# Altium schematic sheet Open_Rally_Computer_ports.SchDoc
size 594 x 420 mm
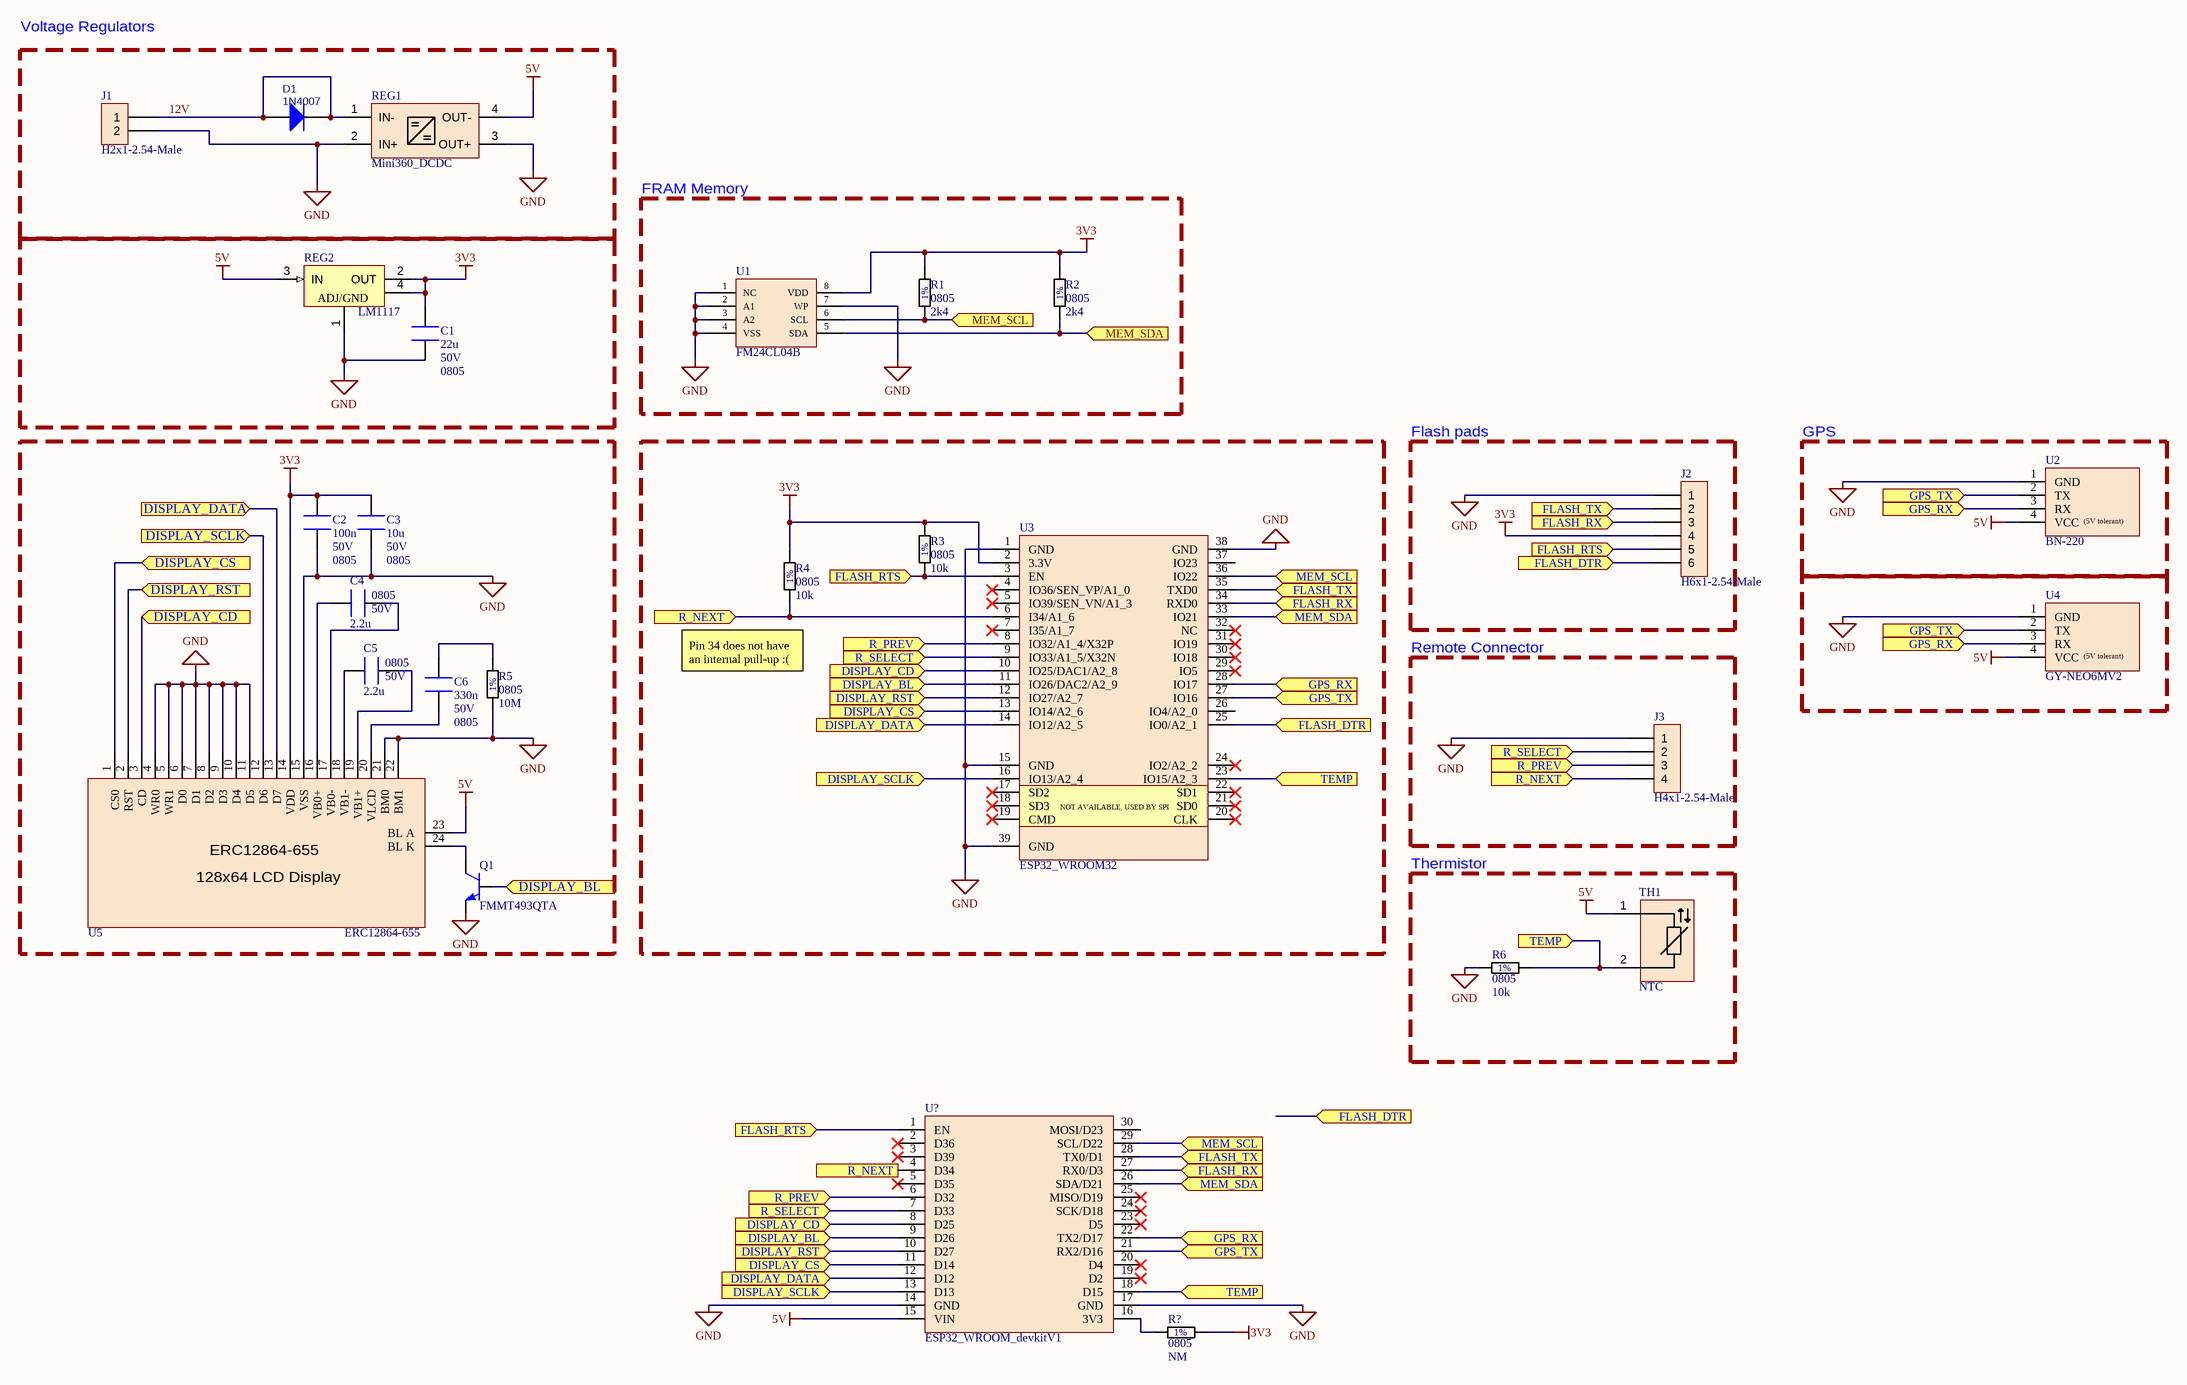
[diagram p0: Open_Rally_Computer_ports.SchDoc]

## Parts
C1  value 22u  Voltage: 50V  Case: 0805  [C0805]  (hidden comment: CAP_CERAMIC_0805)
C2  value 100n  Voltage: 50V  Case: 0805  [C0805]  (hidden comment: CAP_CERAMIC_0805)
C3  value 10u  Voltage: 50V  Case: 0805  [C0805]  (hidden comment: CAP_CERAMIC_0805)
C4  value 2.2u  Voltage: 50V  Case: 0805  [C0805]  (hidden comment: CAP_CERAMIC_0805)
C5  value 2.2u  Voltage: 50V  Case: 0805  [C0805]  (hidden comment: CAP_CERAMIC_0805)
C6  value 330n  Voltage: 50V  Case: 0805  [C0805]  (hidden comment: CAP_CERAMIC_0805)
D1  1N4007  [SOD-123F]
J1  H2x1-2.54-Male  [HDR_P254_2x1]
J2  H6x1-2.54-Male  [HDR_P254_6x1]
J3  H4x1-2.54-Male  [HDR_P254_4x1]
Q1  FMMT493QTA  [SOT-23]
R1  value 2k4  Case: 0805  Tolerance: 1%  [R0805]  (hidden comment: RES_0805)
R2  value 2k4  Case: 0805  Tolerance: 1%  [R0805]  (hidden comment: RES_0805)
R3  value 10k  Case: 0805  Tolerance: 1%  [R0805]  (hidden comment: RES_0805)
R4  value 10k  Case: 0805  Tolerance: 1%  [R0805]  (hidden comment: RES_0805)
R5  value 10M  Case: 0805  Tolerance: 1%  [R0805]  (hidden comment: RES_0805)
R6  value 10k  Case: 0805  Tolerance: 1%  [R0805]  (hidden comment: RES_0805)
R?  value NM  Case: 0805  Tolerance: 1%  [R0805]  (hidden comment: RES_0805)
REG1  Mini360_DCDC  [Mini360-DCDC]
REG2  LM1117  [SOT-223-4]
TH1  NTC  [HDR_P254_2x1]
U1  FM24CL04B  [SOIC-8N]
U2  BN-220  [BN-220]
U3  ESP32_WROOM32  [ESP32_WROOM]
U4  GY-NEO6MV2  [GY-NEO6MV2]
U5  ERC12864-655  [ERC12864-655]
U?  ESP32_WROOM_devkitV1  [ESP32_WROOM_32S_devkitV1]

## Blocks framed on the sheet
Voltage Regulators: D1 J1 REG1
FRAM Memory: R1 R2 U1
Flash pads: J2
GPS: U2
Remote Connector: J3
Thermistor: R6 TH1

## Ports
DISPLAY_BL (in), DISPLAY_CD (in), DISPLAY_CS (in), DISPLAY_DATA (in), DISPLAY_RST (in), DISPLAY_SCLK (in), FLASH_DTR (in), FLASH_RTS (in), FLASH_RX (in), FLASH_TX (in), GPS_RX (in), GPS_TX (in), MEM_SCL (in), MEM_SDA (in), R_NEXT (in), R_PREV (in), R_SELECT (in), TEMP (in)

## Nets
3V3: C1.2 C2.2 C3.2 J2.4 R1.2 R2.2 R3.1 R4.1 R?.2 REG2.2(OUT) REG2.4(OUT) U1.8(VDD) U3.2(3.3V) U5.14(VDD)
5V: REG1.4(OUT-) REG2.3(IN) TH1.1 U2.4(VCC) U4.4(VCC) U5.23(BL_A) U?.15(VIN)
GND: C1.1 C2.1 C3.1 J1.2 J2.1 J3.1 Q1.2(E) R5.1 R6.1 REG1.2(IN+) REG1.3(OUT+) REG2.1(ADJ) U1.1(NC) U1.2(A1) U1.3(A2) U1.4(VSS) U1.7(WP) U2.1(GND) U3.1(GND) U3.15(GND) U3.38(GND) U3.39(GND) U4.1(GND) U5.4(WR0) U5.5(WR1) U5.6(D0) U5.7(D1) U5.8(D2) U5.9(D3) U5.10(D4) U5.11(D5) U5.15(VSS) U5.21(BM0) U5.22(BM1) U?.14(GND) U?.17(GND)
12V: D1.1(K) D1.2(A) J1.1 REG1.1(IN-)
DISPLAY_BL: Q1.1(B) U3.11(IO26/DAC2/A2_9) U?.9(D26) ; port DISPLAY_BL
DISPLAY_CD: U3.10(IO25/DAC1/A2_8) U5.3(CD) U?.8(D25) ; port DISPLAY_CD
DISPLAY_CS: U3.13(IO14/A2_6) U5.1(CS0) U?.11(D14) ; port DISPLAY_CS
DISPLAY_DATA: U3.14(IO12/A2_5) U5.13(D7) U?.12(D12) ; port DISPLAY_DATA
DISPLAY_RST: U3.12(IO27/A2_7) U5.2(RST) U?.10(D27) ; port DISPLAY_RST
DISPLAY_SCLK: U3.16(IO13/A2_4) U5.12(D6) U?.13(D13) ; port DISPLAY_SCLK
FLASH_DTR: J2.6 U3.25(IO0/A2_1) ; port FLASH_DTR
FLASH_RTS: J2.5 R3.2 U3.3(EN) U?.1(EN) ; port FLASH_RTS
FLASH_RX: J2.3 U3.34(RXD0) U?.27(RX0/D3) ; port FLASH_RX
FLASH_TX: J2.2 U3.35(TXD0) U?.28(TX0/D1) ; port FLASH_TX
GPS_RX: U2.3(RX) U3.28(IO17) U4.3(RX) U?.22(TX2/D17) ; port GPS_RX
GPS_TX: U2.2(TX) U3.27(IO16) U4.2(TX) U?.21(RX2/D16) ; port GPS_TX
MEM_SCL: R1.1 U1.6(SCL) U3.36(IO22) U?.29(SCL/D22) ; port MEM_SCL
MEM_SDA: R2.1 U1.5(SDA) U3.33(IO21) U?.26(SDA/D21) ; port MEM_SDA
R_NEXT: J3.4 R4.2 U3.6(I34/A1_6) U?.4(D34) ; port R_NEXT
R_PREV: J3.3 U3.8(IO32/A1_4/X32P) U?.6(D32) ; port R_PREV
R_SELECT: J3.2 U3.9(IO33/A1_5/X32N) U?.7(D33) ; port R_SELECT
TEMP: R6.2 TH1.2 U3.23(IO15/A2_3) U?.18(D15) ; port TEMP
NetC4_1: C4.1 U5.17(VB0-)
NetC4_2: C4.2 U5.16(VB0+)
NetC5_1: C5.1 U5.19(VB1+)
NetC5_2: C5.2 U5.18(VB1-)
NetC6_1: C6.1 U5.20(VLCD)
NetC6_2: C6.2 R5.2
NetQ1_3: Q1.3(C) U5.24(BL_K)
NetR?_1: R?.1 U?.16(3V3)

Not connected (* = marked no-connect by the designer): U3 4(IO36/SEN_VP/A1_0)* 5(IO39/SEN_VN/A1_3)* 7(I35/A1_7)* 17(SD2)* 18(SD3)* 19(CMD)* 20(CLK)* 21(SD0)* 22(SD1)* 24(IO2/A2_2)* 26(IO4/A2_0) 29(IO5)* 30(IO18)* 31(IO19)* 32(NC)* 37(IO23); U? 2(D36)* 3(D39)* 5(D35)* 19(D2)* 20(D4)* 23(D5)* 24(SCK/D18)* 25(MISO/D19)* 30(MOSI/D23)

## Notes on the sheet
- (near R4) Pin 34 does not have
  an internal pull-up :(
- DWG NO:
- REV:
- THIS DOCUMENT AND THE DATA DISCLOSED HEREIN OR
- HEREWITH IS THE PROPERTY OF ALTIUM LIMITED AND MAY
- BE FREELY DISTRIBUTED IN WHOLE. NO RIGHTS ARE
- RESERVED OR EXPRESS OR IMPLIED WARANTEE GIVEN.
- REVISION
- DESCRIPTION
- DATE
- APPROVED
- ENG:
- APPROVALS
- PROJECT
- DSN:
- CHK:
- REFERENCE DOCUMENTS
- PROJECT REVISION:
- TITLE
- DOCUMENT REVISION:
- DESIGN ITEM:
- BOM:
- FAB DWG:
- PCB DWG:
- ASSY DWG:
- SCALE:
- A2
- SIZE
- CAGE CODE
- FILE NAME
- DWG NO.
- SHEET
- OF
- REV
- (in symbol BN-220) (5V tolerant)
- (in symbol ERC12864-655) 128x64 LCD Display
- (in symbol ESP32_WROOM32) NOT AVAILABLE, USED BY SPI
- (in symbol GY-NEO6MV2) (5V tolerant)
- (in symbol LM1117) ADJ/GND

## Library data of the parts
C1-C6 = CAP_CERAMIC_0805: Capacitor Ceramic 0805 No Polarized; 01_Type: CAPACITOR; 02_Generic Part Number: *; 03_Part Number: *; 04_Manufacturer: *; 05_RS Part Number: *; 06_Farnell Part Number: *; 07_Mouser Part Number: *; 08_Digi-Key Part Number: *; 09_helpURL: *; Check Footprint: NO; Check Symbol: NO
D1 = 1N4007: BOM_Manufacturer: Hottech; Contributor: LCSC; BOM_Supplier Part: C181127; BOM_Supplier: LCSC; BOM_Manufacturer Part: 1N4007; spicePre: D
J1 = H2x1-2.54-Male: Header male 2x1 2.54mm; 01_Type: Connectors
J2 = H6x1-2.54-Male: Header female 6x1 2.54mm; 01_Type: Connectors
J3 = H4x1-2.54-Male: Header male 4x1 2.54mm; 01_Type: Connectors
Q1 = FMMT493QTA: Transistores bipolares - BJT 100V NPN Med PWR 1A Ic 2A Icm 500mW; 04_Manufacturer: Diodes Incorporated; 01_Type: BJT-P; Check Footprint: NO; 03_Part Number: FMMT493QTA; 07_Mouser Part Number: 621-FMMT493QTA; Value: FMMT493QTA; Check Symbol: NO
R1-R6 R? = RES_0805: Resistor 0805; Check Footprint: NO; 01_Type: RESISTOR; 02_Generic Part Number: *; 03_Part Number: *; 04_Manufacturer: *; 05_RS Part Number: *; 06_Farnell Part Number: *; 07_Mouser Part Number: *; 08_Digi-Key Part Number: *; 09_helpURL: *; Power: *; Check Symbol: NO
REG1 = Mini360_DCDC: Mini360 DC-DC Buck Converter Step Down Power Supply Module 4.75V-23V to 1V-17V 340KHz; 01_Type: Regulators; 02_Generic Part Number: Mini360_DCDC
REG2 = LM1117: Reguladores de voltaje LDO 800MA LDO LINEAR REG; 03_Part Number: LM1117MPX-3.3/NOPB; 04_Manufacturer: TEXAS INSTRUMENTS; 01_Type: Regulators; 02_Generic Part Number: LM1117; 07_Mouser Part Number: 926-LM1117MPX3.3NOPB; Value: LM1117; Component Kind: Standard
TH1 = NTC: NTC thermistor; 01_Type: Connector
U1 = FM24CL04B: F-RAM 4Kb Serial I2C 3V FRAM; 03_Part Number: FM24CL04B-GTR; 04_Manufacturer: Infineon Technologies; 01_Type: IC; 02_Generic Part Number: FM24CL04B; 07_Mouser Part Number: 877-FM24CL04B-GTR
U2 = BN-220: Beitian UBX G7020 M8030 G-MOUSE supports GPS QZSS and SBAS; 01_Type: IC; 02_Generic Part Number: BN-220; 03_Part Number: BN-220; 04_Manufacturer: Beitian
U3 = ESP32_WROOM32: Módulos multiprotocolo SMD Module ESP32-WROOM-32E, ESP32-D0WD-V3, 16 MB SPI flash, PCB antenna; 03_Part Number: ESP32-WROOM-32E-N16; 04_Manufacturer: Espressif Systems; 01_Type: IC; 02_Generic Part Number: ESP32-WROOM; 07_Mouser Part Number: 356-ESP32WRM32E128PH
U4 = GY-NEO6MV2: uBlox Neo 6M breakout board; 04_Manufacturer: Beitian; 01_Type: IC; 02_Generic Part Number: GY-NEO6MV2; 03_Part Number: GY-NEO6MV2
U5 = ERC12864-655: 2.8"128x64 Graphic Module Serial Display SPI LCD w/OPTL Touch Screen; 04_Manufacturer: EastRising; 01_Type: IC; 02_Generic Part Number: ERC12864-655; 03_Part Number: ERC12864-655; 09_helpURL: https://www.buydisplay.com/2-8-inch-128x64-graphic-module-serial-display-spi-lcd-w-optl-touch-screen
U? = ESP32_WROOM_devkitV1: Módulos multiprotocolo SMD Module ESP32-WROOM-32E, ESP32-D0WD-V3, 16 MB SPI flash, PCB antenna; 03_Part Number: ESP32-WROOM-32E-N16; 04_Manufacturer: Espressif Systems; 01_Type: IC; 02_Generic Part Number: ESP32-WROOM; 07_Mouser Part Number: 356-ESP32WRM32E128PH; 09_helpURL: https://docs.espressif.com/projects/esp-idf/en/latest/esp32/hw-reference/esp32/get-started-devkitc.html